# Altium schematic sheet CPLD.SchDoc
size A4; SheetNumber: 7; SheetTotal: 10
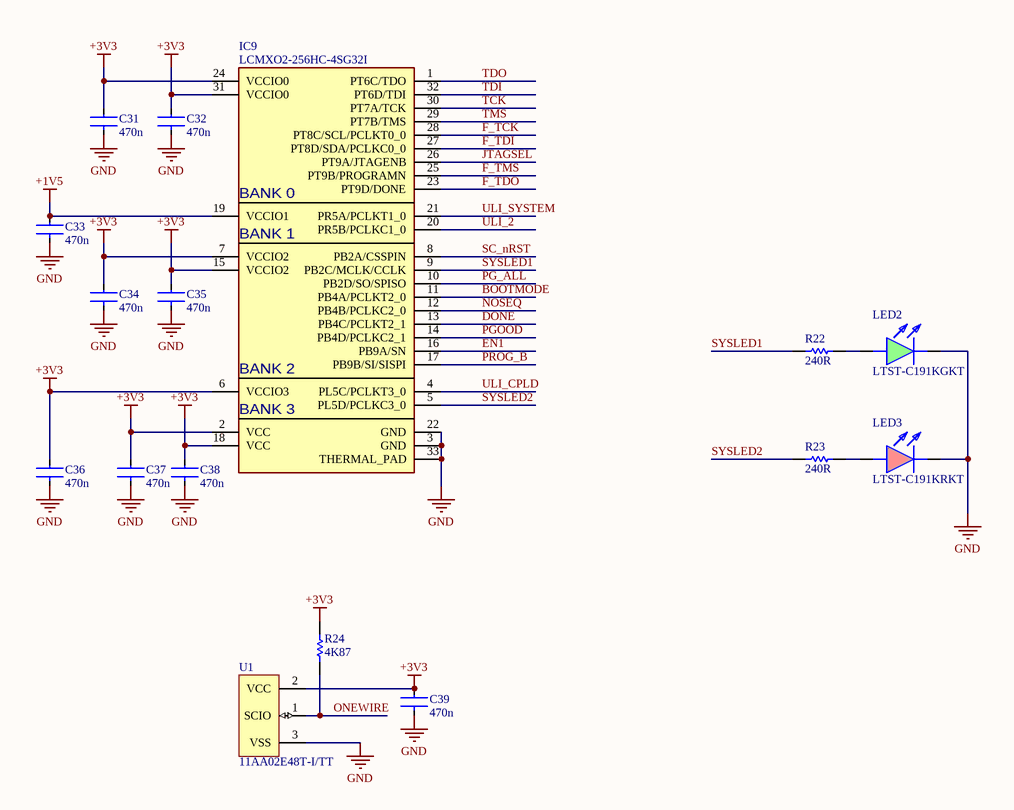
[diagram p0: CPLD.SchDoc]

## Parts
C31  value 470n  [FP-C1005-050-0_05-IPC_B]  (hidden comment: C1005X5R1E474K050BB)
C32  value 470n  [FP-C1005-050-0_05-IPC_B]  (hidden comment: C1005X5R1E474K050BB)
C33  value 470n  [FP-C1005-050-0_05-IPC_B]  (hidden comment: C1005X5R1E474K050BB)
C34  value 470n  [FP-C1005-050-0_05-IPC_B]  (hidden comment: C1005X5R1E474K050BB)
C35  value 470n  [FP-C1005-050-0_05-IPC_B]  (hidden comment: C1005X5R1E474K050BB)
C36  value 470n  [FP-C1005-050-0_05-IPC_B]  (hidden comment: C1005X5R1E474K050BB)
C37  value 470n  [FP-C1005-050-0_05-IPC_B]  (hidden comment: C1005X5R1E474K050BB)
C38  value 470n  [FP-C1005-050-0_05-IPC_B]  (hidden comment: C1005X5R1E474K050BB)
C39  value 470n  [FP-C1005-050-0_05-IPC_B]  (hidden comment: C1005X5R1E474K050BB)
IC9  LCMXO2-256HC-4SG32I  [QFN50P500X500X60-33N]
LED2  LTST-C191KGKT  [LEDC1608X55N]
LED3  LTST-C191KRKT  [LEDC1608X55N]
R22  value 240R  [RESC0402(1005)_L]  (hidden comment: RC0402FR-07240RL)
R23  value 240R  [RESC0402(1005)_L]  (hidden comment: RC0402FR-07240RL)
R24  value 4K87  [RESC1005X40X25LL05T10]  (hidden comment: RC0402FR-074K87L)
U1  11AA02E48T-I/TT  [SOT-23-TT3_M]

## Nets
+1V5: C33.2 IC9.19(VCCIO1)
+3V3: C31.2 C32.2 C34.2 C35.2 C36.2 C37.2 C38.2 C39.2 IC9.2(VCC) IC9.6(VCCIO3) IC9.7(VCCIO2) IC9.15(VCCIO2) IC9.18(VCC) IC9.24(VCCIO0) IC9.31(VCCIO0) R24.1 U1.2(VCC)
GND: C31.1 C32.1 C33.1 C34.1 C35.1 C36.1 C37.1 C38.1 C39.1 IC9.3(GND) IC9.22(GND) IC9.33(THERMAL_PAD) LED2.1(K) LED3.1(K) U1.3(VSS)
BOOTMODE: IC9.11(PB4A/PCLKT2_0)
DONE: IC9.13(PB4C/PCLKT2_1)
EN1: IC9.16(PB9A/SN)
F_TCK: IC9.28(PT8C/SCL/PCLKT0_0)
F_TDI: IC9.27(PT8D/SDA/PCLKC0_0)
F_TDO: IC9.23(PT9D/DONE)
F_TMS: IC9.25(PT9B/PROGRAMN)
JTAGSEL: IC9.26(PT9A/JTAGENB)
NOSEQ: IC9.12(PB4B/PCLKC2_0)
ONEWIRE: R24.2 U1.1(SCIO)
PG_ALL: IC9.10(PB2D/SO/SPISO)
PGOOD: IC9.14(PB4D/PCLKC2_1)
PROG_B: IC9.17(PB9B/SI/SISPI)
SC_nRST: IC9.8(PB2A/CSSPIN)
SYSLED1: IC9.9(PB2C/MCLK/CCLK) R22.2
SYSLED2: IC9.5(PL5D/PCLKC3_0) R23.2
TCK: IC9.30(PT7A/TCK)
TDI: IC9.32(PT6D/TDI)
TDO: IC9.1(PT6C/TDO)
TMS: IC9.29(PT7B/TMS)
ULI_2: IC9.20(PR5B/PCLKC1_0)
ULI_CPLD: IC9.4(PL5C/PCLKT3_0)
ULI_SYSTEM: IC9.21(PR5A/PCLKT1_0)
NetLED2_2: LED2.2(A) R22.1
NetLED3_2: LED3.2(A) R23.1

## Notes on the sheet
- (in symbol LCMXO2-256HC-4SG32I) BANK 0; BANK 1; BANK 2; BANK 3

## Library data of the parts
C31-C39 = CMP-2000-06003-2: Multilayer Ceramic Capacitors 470nF ±10% 25V X5R SMD 0402; Dissipation Factor: 10%; Case Code (Metric): 1005; RoHS Compliant: Yes; Lead Free: Lead Free; Length: 1mm; Case/Package: 0402; Termination: SMD/SMT; Voltage Rating: 25V; Dielectric Material: Ceramic; Dielectric: X5R; Depth: 0.5mm; Series: C; Voltage: 25V; Tolerance: 10%; Packaging: Tape and Reel; Resistor Type: Ceramic; Min Operating Temperature: -55°C; Width: 0.02inch; Thickness: 500um; Package Quantity: 10000; Case Code (Imperial): 0402; Construction: Flat; Height: 0.5mm; REACH SVHC: No SVHC; Radiation Hardening: No; Weight: 2.3E-05oz; Mount: Surface Mount; Voltage Rating (DC): 25V; Max Operating Temperature: 85°C; Part Number: C1005X5R1E474K050BB
IC9 = LCMXO2-256HC-4SG32I: Integrated Circuit; Manufacturer_Name: Lattice Semiconductor; Datasheet Link: https://datasheet.datasheetarchive.com/originals/distributors/Datasheets-DGA19/41708.pdf; Height: 0.6mm; Manufacturer_Part_Number: LCMXO2-256HC-4SG32I; Mouser Part Number: 842-LCXO2256HC4SG32I; Mouser Price/Stock: https://www.mouser.co.uk/ProductDetail/Lattice/LCMXO2-256HC-4SG32I?qs=0pXo3msJWLP4CWqvg3QOuw%3D%3D; Arrow Part Number: LCMXO2-256HC-4SG32I; Arrow Price/Stock: https://www.arrow.com/en/products/lcmxo2-256hc-4sg32i/lattice-semiconductor?region=nac
LED2 = LTST-C191KGKT: LED; Manufacturer_Name: Lite-On; Value: Green; Datasheet Link: http://www.mouser.com/ds/2/239/S_110_LTST-C191KGKT-369560.pdf; Height: 0.55mm; Mouser Part Number: 859-LTST-C191KGKT; Mouser Price/Stock: https://www.mouser.co.uk/ProductDetail/Lite-On/LTST-C191KGKT?qs=xSPZu9B1aMCRQ5ACasEYAg%3D%3D; Arrow Part Number: LTST-C191KGKT; Arrow Price/Stock: https://www.arrow.com/en/products/ltst-c191kgkt/lite-on-technology.html?utm_currency=USD&region=europe; Part Number: LTST-C191KGKT
LED3 = LTST-C191KRKT: LED; Manufacturer_Name: Lite-On; Datasheet Link: http://www.mouser.com/ds/2/239/S_110_LTST-C191KRKT-539838.pdf; Height: 0.55mm; Mouser Part Number: 859-LTST-C191KRKT; Mouser Price/Stock: https://www.mouser.co.uk/ProductDetail/LITEON/LTST-C191KRKT?qs=BAIUz4Y8PJBLfOhzue0q%252BA%3D%3D; Arrow Part Number: LTST-C191KRKT; Arrow Price/Stock: https://www.arrow.com/en/products/ltst-c191krkt/lite-on-technology?utm_currency=USD&region=nac; Part Number: LTST-C191KRKT
R22 R23 = CMP-1011-00438-1: 240R 0.063W 1% 0402 (1005 Metric)  SMD; Case-Metric: 1005; Case-EIA: 0402; Power: 0.063 W; Tolerance: 1 %; Technology: SMT; Part Number: RC0402FR-07240RL; Parameter 1: *
R24 = CMP-2002-07716-1: Manufacturer: Yageo / Phycomp; Part Number: RC0402FR-074K87L; Parameter 1: *
U1 = CMP-0167-00048-1: 2K UNI/O® Serial EEPROM with EUI-48 Node Identity, 3-Pin SOT-23, Industrial Temperature, Tape and Reel; DatasheetVersion: revA, Dec-2008; PackageReference: SOT-23-TT3; PackageDescription: 3-Lead Plastic Small Outline Transistor (TT) [SOT-23]; PackageVersion: revBB, Aug-2009; Code_IPC: SOT23-3